# EAGLE design dc-usb7-final (EAGLE 5.09)
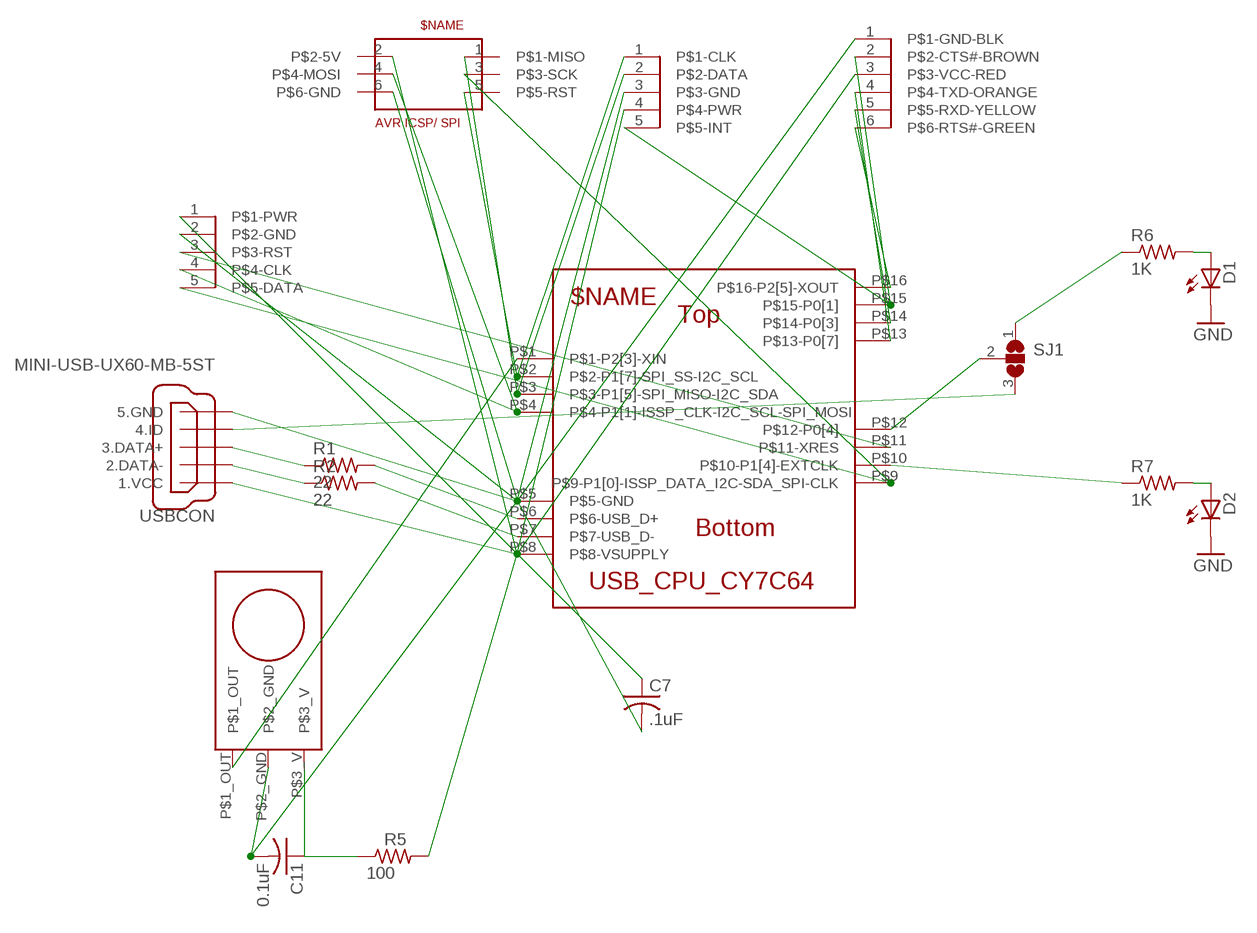
[diagram p0: schematic, sheet 1]

## Parts
AVR_ICSP  AVR_ICSP-SPI  [2X03]
C7  .1uF  C-USC0603  [C0603]
C11  0.1uF  RCL_C-USC0603  [RCL_C0603]
CY7C64  USB_CPU_CY7C64315  [QFN16-3X3]
CY_ICSP  CY_ICSP  [1X05]
D1  LEDCHIPLED_1206  [CHIPLED_1206]
D2  LEDCHIPLED_1206  [CHIPLED_1206]
FTDI  FTDI  [1X06]
I2C  I2CHDR  [1X05]
IR_RECV  TSOP34138_IR_RECIEVER  [TSOP34138]
R1  22  R-US_R0603  [R0603]
R2  22  R-US_R0603  [R0603]
R5  100  R-US_R0603  [R0603]
R6  1K  R-US_R0603  [R0603]
R7  1K  R-US_R0603  [R0603]
SJ1  SJ2W  [SJ_2]
USBCON  MINI-USB-UX60-MB-5ST  [UX60-MB-5ST]

## Nets
GND [GND]: AVR_ICSP.6(P$6-GND) C7.2 C11.2 CY7C64.P$5(P$5-GND) CY_ICSP.2(P$2-GND) D1.C D2.C FTDI.1(P$1-GND-BLK) I2C.3(P$3-GND) IR_RECV.P$2_GND USBCON.5(5.GND)
N$1: R1.1 USBCON.3(3.DATA+)
N$2: CY7C64.P$7(P$7-USB_D-) R2.2
N$3: CY7C64.P$6(P$6-USB_D+) R1.2
N$4: R6.1 SJ1.1
N$5: SJ1.3 USBCON.4(4.ID)
N$6: CY7C64.P$12(P$12-P0[4]) SJ1.2
N$10: CY7C64.P$11(P$11-XRES) CY_ICSP.3(P$3-RST)
N$17: AVR_ICSP.4(P$4-MOSI) CY7C64.P$4(P$4-P1[1]-ISSP_CLK-I2C_SCL-SPI_MOSI) CY_ICSP.4(P$4-CLK)
N$18: AVR_ICSP.3(P$3-SCK) CY7C64.P$9(P$9-P1[0]-ISSP_DATA_I2C-SDA_SPI-CLK) CY_ICSP.5(P$5-DATA)
N$19: AVR_ICSP.1(P$1-MISO) CY7C64.P$3(P$3-P1[5]-SPI_MISO-I2C_SDA) I2C.2(P$2-DATA)
N$20: AVR_ICSP.5(P$5-RST) CY7C64.P$2(P$2-P1[7]-SPI_SS-I2C_SCL) I2C.1(P$1-CLK)
N$21: CY7C64.P$13(P$13-P0[7]) FTDI.4(P$4-TXD-ORANGE)
N$22: CY7C64.P$14(P$14-P0[3]) FTDI.5(P$5-RXD-YELLOW)
N$23: CY7C64.P$15(P$15-P0[1]) FTDI.2(P$2-CTS#-BROWN) I2C.5(P$5-INT)
N$24: CY7C64.P$16(P$16-P2[5]-XOUT) FTDI.6(P$6-RTS#-GREEN)
N$25: CY7C64.P$1(P$1-P2[3]-XIN) IR_RECV.P$1_OUT
N$26: D1.A R6.2
N$37: D2.A R7.2
N$39: CY7C64.P$10(P$10-P1[4]-EXTCLK) R7.1
N$118: C11.1 IR_RECV.P$3_V R5.1
PGM_PWR [PWR]: AVR_ICSP.2(P$2-5V) C7.1 CY7C64.P$8(P$8-VSUPPLY) CY_ICSP.1(P$1-PWR) FTDI.3(P$3-VCC-RED) I2C.4(P$4-PWR) R5.2 USBCON.1(1.VCC)
USB_DM: R2.1 USBCON.2(2.DATA-)

## Library data of the parts
AVR_ICSP = duinochip:AVR_ICSP-SPI
C7 = rcl:C-US: CAPACITOR, American symbol
C11 = lightuino3.lbrlightuino3.1:RCL_C-US: CAPACITOR, American symbol
CY7C64 = duinochip:USB_CPU_CY7C64315
CY_ICSP = duinochip:CY_ICSP
D1 D2 = led:LED: LED OSRAM: - CHIPLED LG R971, LG N971, LY N971, LG Q971, LY Q971, LO R971, LY R971 LH N974, LH R974 LS Q976, LO Q976, LY Q976 LO Q996 - Hyper CHIPLED LW Q18S LB Q993, LB Q99A, LB R99A - SideLED LS A670, LO A670, LY A670, LG A670, LP A670 LB A673, LV A673, LT A673, LW A673 LH A674 LY A675 LS A676, LA A676, LO A676, LY A676, LW A676 LS A679, LY A679, LG A679 - Hyper Micro SIDELED® LS Y876, LA Y876, LO Y876, LY Y876 LT Y87S - SmartLED LW L88C, LW L88S LB L89C, LB L89S, LG L890 LS L89K, LO L89K, LY L89K LS L896, LA L896, LO L896, LY L896 - TOPLED LS T670, LO T670, LY T670, LG T670, LP T670 LSG T670, LSP T670, LSY T670, LOP T670, LYG T670 LG T671, LOG T671, LSG T671 LB T673, LV T673, LT T673, LW T673 LH T674 LS T676, LA T676, LO T676, LY T676, LB T676, LH T676, LSB T676, LW T676 LB T67C, LV T67C, LT T67C, LS T67K, LO T67K, LY T67K, LW E67C LS E67B, LA E67B, LO E67B, LY E67B, LB E67C, LV E67C, LT E67C LW T67C LS T679, LY T679, LG T679 LS T770, LO T770, LY T770, LG T770, LP T770 LB T773, LV T773, LT T773, LW T773 LH T774 LS E675, LA E675, LY E675, LS T675 LS T776, LA T776, LO T776, LY T776, LB T776 LHGB T686 LT T68C, LB T68C - Hyper Mini TOPLED® LB M676 - Mini TOPLED Santana® LG M470 LS M47K, LO M47K, LY M47K Source: http://www.osram.convergy.de LUXEON: - LUMILED® LXK2-PW12-R00, LXK2-PW12-S00, LXK2-PW14-U00, LXK2-PW14-V00 LXK2-PM12-R00, LXK2-PM12-S00, LXK2-PM14-U00 LXK2-PE12-Q00, LXK2-PE12-R00, LXK2-PE12-S00, LXK2-PE14-T00, LXK2-PE14-U00 LXK2-PB12-K00, LXK2-PB12-L00, LXK2-PB12-M00, LXK2-PB14-N00, LXK2-PB14-P00, LXK2-PB14-Q00 LXK2-PR12-L00, LXK2-PR12-M00, LXK2-PR14-Q00, LXK2-PR14-R00 LXK2-PD12-Q00, LXK2-PD12-R00, LXK2-PD12-S00 LXK2-PH12-R00, LXK2-PH12-S00 LXK2-PL12-P00, LXK2-PL12-Q00, LXK2-PL12-R00 Source: www.luxeon.com KINGBRIGHT: KA-3528ASYC Source: www.kingbright.com
FTDI = duinochip:FTDI
I2C = duinochip:I2CHDR
IR_RECV = lightuino3.lbrlightuino3.1:TSOP34138_IR_RECIEVER
R1 R2 R5-R7 = resistor:R-US_: RESISTOR, American symbol
SJ1 = jumper:SJ2W: SMD solder JUMPER
USBCON = duinochip:MINI-USB-: MINI USB Connector Source: http://www.hirose.co.jp/cataloge_hp/e24000019.pdf

## Net classes
1 PWR: width 0.305 mm, clearance 0.203 mm
2 GND: width 0.508 mm, clearance 0.203 mm
3 CHIPCOM: width 0.203 mm, clearance 0.152 mm
4 solder: clearance 1.524 mm

## Board
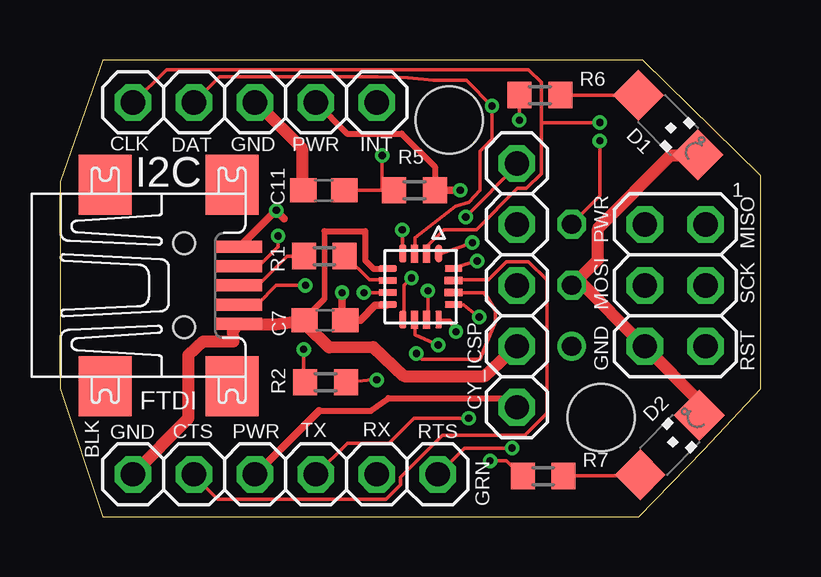
[diagram p1: board, top side]
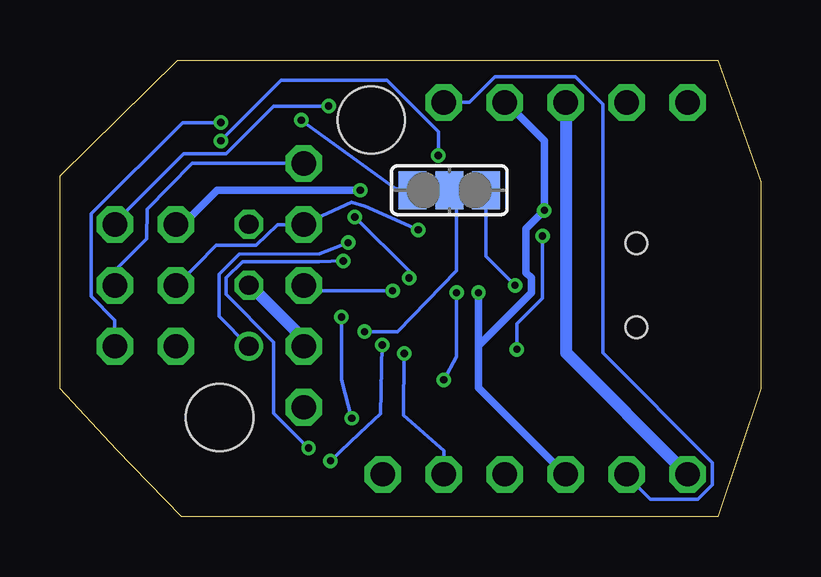
[diagram p2: board, bottom side, seen from below]

Size 29.21 x 19.04 mm. Coordinates in mm from the lower left corner, seen from the top.
Outline: 1.78,0 24.13,0 26.85,2.79 29.21,5.33 29.21,14.22 24.31,19.04 1.78,19.04 0,13.97 0,5.33 1.78,0
Copper layers (1*16): Top 0.035mm / dielectric 1.5mm / Bottom 0.035mm
Design rules "ourpcb *": minimum track width 6mil, minimum drill 0.3mm, track to track 6mil, track to pad 6mil, pad to pad 6mil, via to via 6mil, smd to smd 6mil, copper to edge 0.15mm, drill to drill 8mil, minimum pad ring 0.15mm, minimum via ring 0.15mm, stop-mask expansion 4mil, vias tented up to drill 25mil, thermal gap 10mil
Holes 2.8 mm at 16.23,16.54 22.56,4.14

### Footprints (pad centres in the part's own frame; a part is rotated, then mirrored left to right if it is on the bottom)
2X03 = drill 1.016 octagon: 1 -2.54,1.27; 2 -2.54,-1.27; 3 0,1.27; 4 0,-1.27; 5 2.54,1.27; 6 2.54,-1.27
C0603 = smd 1.1 x 1: 1 -0.85,0; 2 0.85,0
RCL_C0603 = smd 1.1 x 1: 1 -0.85,0; 2 0.85,0
QFN16-3X3 = smd 0.75 x 0.3: P$1 -1.375,0.75; P$2 -1.375,0.25; P$3 -1.375,-0.25; P$10 1.375,-0.25; P$11 1.375,0.25 | smd 0.737 x 0.279: P$4 -1.375,-0.75; P$9 1.375,-0.75; P$12 1.375,0.75 | smd 0.279 x 0.737: P$5 -0.75,-1.375; P$6 -0.25,-1.375; P$7 0.25,-1.375; P$8 0.75,-1.375; P$13 0.75,1.375; P$16 -0.75,1.375 | smd 0.3 x 0.75: P$14 0.25,1.375; P$15 -0.25,1.375
1X05 = drill 1.016 octagon: 1 -5.08,0; 2 -2.54,0; 3 0,0; 4 2.54,0; 5 5.08,0
CHIPLED_1206 = smd 1.5 x 1.5: A 0,-1.75; C 0,1.75
1X06 = drill 1.016 octagon: 1 -6.35,0; 2 -3.81,0; 3 -1.27,0; 4 1.27,0; 5 3.81,0; 6 6.35,0
TSOP34138 = drill 0.8 round: P$1_OUT -2.54,0 | drill 0.8 octagon: P$2_GND 0,0; P$3_V 2.54,0
R0603 = smd 1 x 1.1: 1 -0.85,0; 2 0.85,0
SJ_2 = smd 1.168 x 1.6: 1 -1.524,0; 2 0,0; 3 1.524,0
UX60-MB-5ST = smd 2 x 0.5: 1 2.25,1.6; 2 2.25,0.8; 3 2.25,0; 4 2.25,-0.8; 5 2.25,-1.6 | smd 2.2 x 2.5: M1 -3.3,-4.2; M2 -3.3,4.2; M3 2,4.2; M4 2,-4.2 | hole 0.9: 0,-1.75; 0,1.75

### Placement (x,y rotation side)
AVR_ICSP  25.65,9.65 270 top
C7  11.05,8.2 180 top
C11  11,13.61 180 top
CY7C64  15.04,9.6 270 top
CY_ICSP  19.05,9.65 90 top
D1  25.35,16.33 225 top
D2  25.43,3 315 top
FTDI  9.4,1.78 0 top
I2C  8.13,17.27 0 top
IR_RECV  21.34,9.65 90 top
R1  11.02,10.87 0 top
R2  11.07,5.61 0 top
R5  14.78,13.61 0 top
R6  20.02,17.58 0 top
R7  20.14,1.7 0 top
SJ1  12.98,13.61 0 bottom
USBCON  5.18,9.65 0 top

### Tracks (layer width: path | path; a pad name or v marks a point on that pad's centre or on a via)
GND
  Top 0.229: 11.02,11.91 11.02,9.09 10.2,8.27 C7.2
  Top 0.254: CY7C64.P$5 13.08,10.34 12.72,10.69 12.72,11.91 11.02,11.91
  Top 0.508: D2.C 26.62,4.24 26.62,4.85 24.41,7.06 AVR_ICSP.6 24.18,7.29 21.74,9.73 IR_RECV.P$2_GND 21.36,9.65 22.43,10.72 22.43,12.01 25.48,15.06 26.54,15.06 D1.C | C11.2 10.08,13.61 10.08,15.37 8.18,17.27 I2C.3 | USBCON.5 7.19,8.05 | 7.22,7.82 7.24,7.31 5.97,7.31 5.36,6.76 5.36,4.12 FTDI.1 | 7.22,7.82 7.21,7.98 | CY_ICSP.2 19,7.06 19.02,7.11 17.7,5.87 14.35,5.87 13.06,7.09 11.23,7.06 10.31,7.98 C7.2 8.99,8.03 7.46,8.03 USBCON.5 | 7.22,7.82 7.26,7.82 USBCON.5
  Bottom 0.508: CY_ICSP.2 19.08,7.14 19.08,7.44 21.28,9.65 IR_RECV.P$2_GND | I2C.3 8.1,17.27 8.1,6.83 FTDI.1
N$1
  Top 0.152: R1.1 9.47,10.87 8.25,9.65 USBCON.3
N$2  (via drill 0.3)
  Top 0.152: v12.68,9.35 13.59,9.35 CY7C64.P$7 | v13.21,5.71 13.23,5.74 11.99,5.61 R2.2
  Bottom 0.152: v12.68,9.35 12.68,6.68 v13.21,5.71
N$3
  Top 0.152: CY7C64.P$6 13.59,9.88 12.9,9.88 11.91,10.87 R1.2
N$4  (via drill 0.3)
  Top 0.152: v19.15,16.54 19.15,17.58 R6.1
  Bottom 0.152: v19.15,16.54 15.24,13.69 SJ1.1
N$5  (via drill 0.3)
  Top 0.152: v10.24,9.65 9.02,9.65 8.25,8.89 7.49,8.89 USBCON.4
  Bottom 0.152: SJ1.3 11.46,10.87 v10.24,9.65
N$6  (via drill 0.3)
  Top 0.152: v16.51,7.72 16.26,8.2 15.8,8.2 CY7C64.P$12
  Bottom 0.152: v16.51,7.72 15.14,7.72 12.68,10.26 12.68,13.31 SJ1.2
N$10  (via drill 0.3)
  Top 0.152: v15.34,9.42 15.34,8.28 CY7C64.P$11
  Bottom 0.152: v15.34,9.42 18.77,9.42 19,9.65 CY_ICSP.3
N$17  (via drill 0.3)
  Top 0.152: v14.28,11.96 14.28,11.02 CY7C64.P$4
  Bottom 0.152: v14.28,11.96 16.48,12.95 17.04,13.11 CY_ICSP.4 19.08,12.17 20.14,12.17 21.03,11.33 22.71,11.33 24.33,9.65 AVR_ICSP.4 24.41,9.65
N$18  (via drill 0.3)
  Top 0.152: v14.66,9.96 14.35,9.65 14.35,8.28 CY7C64.P$9 | v16.92,12.5 19.08,14.68 CY_ICSP.5
  Bottom 0.152: v14.66,9.96 14.66,10.26 v16.92,12.5 | AVR_ICSP.3 26.92,10.26 25.6,11.58 25.58,12.83 23.7,14.73 CY_ICSP.5
N$19  (via drill 0.3)
  Top 0.152: I2C.2 6.66,18.34 13.23,18.34 14.52,18.3 15.57,18.19 16.94,18.19 v18.01,17.12 18.01,15.75 17.5,15.24 17.5,13.61 17.04,13.11 16.48,12.95 14.81,11.63 14.81,11.02 CY7C64.P$3
  Bottom 0.152: v18.01,17.12 20.3,17.12 22.28,15.14 24.05,15.14 26.95,12.24 26.92,12.24 AVR_ICSP.1
N$20  (via drill 0.3)
  Top 0.152: 20.07,16.43 20.07,18.11 19.53,18.64 4.45,18.64 3.07,17.27 I2C.1 | 20.07,16.43 20.07,14.3 19.46,13.69 19.08,13.69 17.37,11.96 16,11.96 15.34,11.33 15.34,11.02 CY7C64.P$2 | 20.07,16.43 v22.5,16.43
  Bottom 0.152: v22.5,16.43 24.1,16.43 27.91,12.62 27.91,9.2 26.92,8.2 AVR_ICSP.5
N$21  (via drill 0.3)
  Top 0.152: v17.48,8.33 16.81,8.84 16.48,8.81 CY7C64.P$13 | v17.04,4.12 14.76,4.12 13.72,3.07 11.99,3.07 FTDI.4
  Bottom 0.152: v17.48,8.33 17.48,5.71 v17.04,4.12
N$22  (via drill 0.3)
  Top 0.152: v14.86,6.81 15.09,6.58 17.5,6.58 18.16,8.13 18.16,8.58 17.7,9.35 16.48,9.35 CY7C64.P$14 | FTDI.5 13.21,1.8
  Bottom 0.152: v14.86,6.81 14.88,4.24 13.21,2.77 FTDI.5
N$23
  Top 0.152: CY7C64.P$15 16.48,9.88 17.86,9.88 18.62,10.64 19.53,10.64 20.3,9.88 20.3,4.32 19.38,3.4 15.95,3.4 14.2,1.65 14.2,1.35 13.59,0.74 6.58,0.74 5.59,1.73 FTDI.2
  Bottom 0.152: I2C.5 12.14,17.27 11.07,18.34 7.72,18.34 6.58,17.2 6.58,6.83 2.01,2.26 2.01,1.35 2.62,0.74 4.6,0.74 5.59,1.73 FTDI.2
N$24  (via drill 0.3)
  Top 0.152: v17.4,10.67 16.48,10.41 CY7C64.P$16 | v18.85,2.87 16.87,2.87 15.8,1.8 FTDI.6
  Bottom 0.152: v17.4,10.67 18.41,10.64 21.59,10.64 22.28,9.96 22.28,9.27 20.3,7.29 20.3,4.32 v18.85,2.87
N$25  (via drill 0.3)
  Top 0.152: v17.2,11.43 15.8,10.95 CY7C64.P$1
  Bottom 0.152: v17.2,11.43 18.39,10.97 21.74,10.95 22.58,10.11 22.58,8.36 IR_RECV.P$1_OUT
N$26
  Top 0.152: R6.2 24.1,17.58 D1.A
N$37
  Top 0.152: R7.2 21.06,1.73 24.18,1.73 D2.A
N$39  (via drill 0.3)
  Top 0.152: v15.77,7.16 14.81,7.59 14.81,8.2 CY7C64.P$10 | v17.93,2.34 18.62,2.34 19.23,1.73 R7.1
  Bottom 0.152: v15.77,7.16 15.85,4.29 16.71,3.48 v17.93,2.34
N$118  (via drill 0.3)
  Top 0.152: C11.1 13.44,13.61 | 13.44,13.61 v13.44,15.06 | v22.5,15.67 22.5,13.39 21.36,12.24 IR_RECV.P$3_V | 13.44,13.61 R5.1
  Bottom 0.152: v13.44,15.06 13.44,16.05 15.57,18.19 19.99,18.19 v22.5,15.67
PGM_PWR  (via drill 0.3)
  Top 0.254: 19.1,4.57 19.06,4.6 18.52,4.95 13.69,4.95 12.95,4.42 10.79,4.42 | 15.98,13.61 15.98,13.64 | R5.2 15.63,14.59 14.25,15.98 11.96,15.98 I2C.4
  Top 0.305: USBCON.1 7.49,11.25 v9.02,12.78 9.35,12.42 | CY7C64.P$8 13.59,8.81 13.13,8.81 12.52,8.2 C7.1 11.76,8.28 v11.76,9.35 | CY_ICSP.1 19.08,4.62 19.06,4.6 | 10.79,4.42 8.18,1.8 FTDI.3 | R5.2 15.98,13.61 v16.69,13.61
  Bottom 0.305: v16.69,13.61 22.66,13.61 24.03,12.24 24.33,12.24 AVR_ICSP.2 | I2C.4 10.62,17.27 9.02,15.67 v9.02,12.78 9.78,12.01 9.78,10.18 9.55,9.96 9.55,9.35 11.68,7.21 11.76,7.21 | 11.76,7.21 11.76,5.38 8.18,1.8 FTDI.3 | 11.76,7.21 v11.76,9.35
USB_DM  (via drill 0.3)
  Top 0.152: v10.16,6.98 10.16,5.61 R2.1 | v9.09,11.71 9.09,11.25 8.33,10.49 7.49,10.49 USBCON.2
  Bottom 0.152: v10.16,6.98 10.16,8.05 9.09,9.12 v9.09,11.71

### Text on the board
tNames: CLK | DAT | GND | PWR | INT | 1 | PWR | MISO | SCK | MOSI | GND | RST | GND | CTS | PWR | TX | RX | RTS | BLK | GRN